# Altium schematic sheet Comm.SchDoc
size C; SheetNumber: 4; SheetTotal: 15
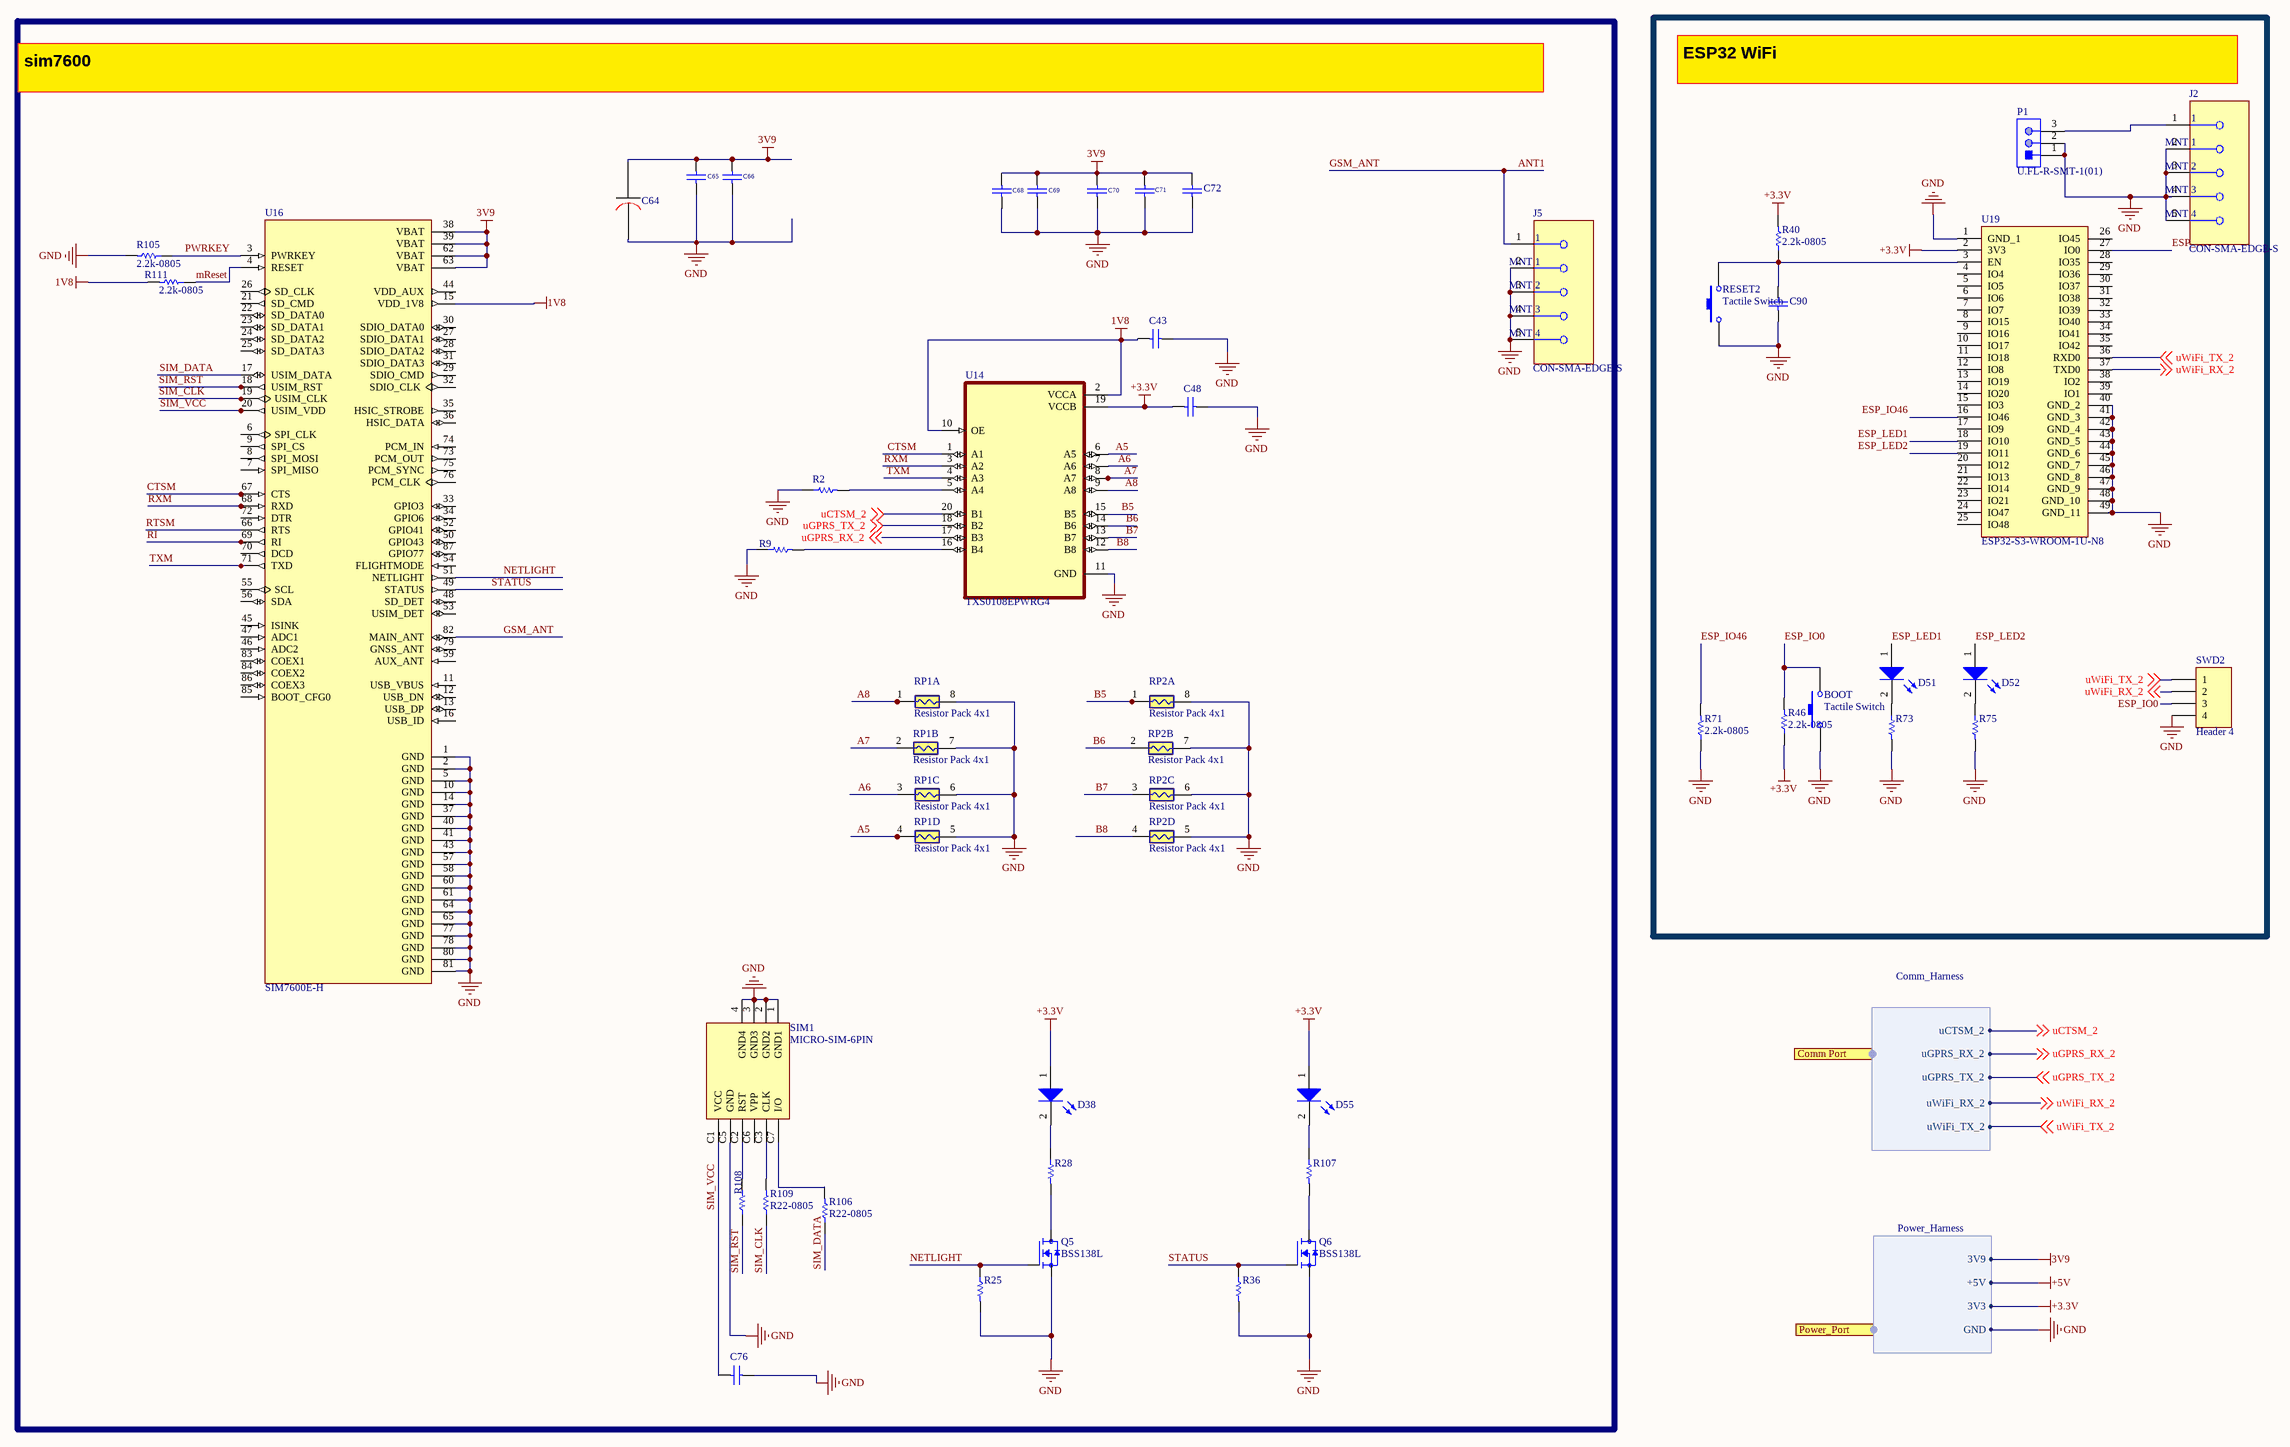
[diagram p0: Comm.SchDoc]

## Parts
BOOT  Tactile Switch  [CRF06031]
C43  Cap  [CRF06031]  (value not drawn)
C48  Cap  [CRF06031]  (value not drawn)
C64  470uF-10V  [CAPACITOR RADIAL SMT size F]  (value not drawn)
C65  (no value)  [CRF06031]
C66  (no value)  [CRF06031]
C68  (no value)  [CRF06031]
C69  (no value)  [CRF06031]
C70  (no value)  [CRF06031]
C71  (no value)  [CRF06031]
C72  (no value)  [CRF06031]
C76  (no value)  [CRF06031]
C90  (no value)  [CRF06031]
D38  LED_0805_green  [0805-LED]  (value not drawn)
D51  LED_0805_green  [0805-LED]  (value not drawn)
D52  LED_0805_green  [0805-LED]  (value not drawn)
D55  LED_0805_green  [0805-LED]  (value not drawn)
J2  CON-SMA-EDGE-S  [FP-CON-SMA-EDGE-S-MFG]
J5  CON-SMA-EDGE-S  [FP-CON-SMA-EDGE-S-MFG]
P1  U.FL-R-SMT-1(01)  [HRS-U.FL-R-SMT-3_V]
Q5  BSS138L  [BSS138L]
Q6  BSS138L  [BSS138L]
R2  (no value)  [CRF06031]
R9  (no value)  [CRF06031]
R25  (no value)  [crf06031]
R28  (no value)  [CRF06031]
R36  (no value)  [crf06031]
R40  2.2k-0805  [CRF06031]
R46  2.2k-0805  [CRF06031]
R71  2.2k-0805  [CRF06031]
R73  (no value)  [CRF06031]
R75  (no value)  [CRF06031]
R105  2.2k-0805  [CRF06031]
R106  R22-0805  [CRF06031]
R107  (no value)  [CRF06031]
R108  R22-0805  [CRF06031]  (value not drawn)
R109  R22-0805  [CRF06031]
R111  2.2k-0805  [CRF06031]
RESET2  Tactile Switch  [CRF06031]
RP1  Resistor Pack 4x1  [RP4x0603]  (parts A,B,C,D of 4)
RP2  Resistor Pack 4x1  [RP4x0603]  (parts A,B,C,D of 4)
SIM1  MICRO-SIM-6PIN  [MICRO-SIM-6PIN]
SWD2  Header 4  [HDR1X4]
U14  TXS0108EPWRG4  [SOP65P640X120-20N]
U16  SIM7600E-H  [IC_SIM7600E-H]
U19  ESP32-S3-WROOM-1U-N8  [ESP32S3WROOM1UN8]

## Ports
Comm Port (harness Comm_Harness), Power_Port (harness Power_Harness)

## Harnesses
Comm_Harness: uCTSM_2, uGPRS_RX_2, uGPRS_TX_2, uWiFi_TX_2, uWiFi_RX_2
Power_Harness: 3V9, +5V, 3V3, GND

## Nets
1V8: C43.1 R111.2 U14.2(VCCA) U14.10(OE) U16.15(VDD_1V8)
3V9: C64.1 C65.2 C66.2 C68.2 C69.2 C70.2 C71.2 C72.2 U16.38(VBAT) U16.39(VBAT) U16.62(VBAT) U16.63(VBAT) ; port Power_Port.3V9
+3.3V: C48.1 D38.1(A) D55.1(A) R40.2 R46.1 U14.19(VCCB) U19.2(3V3) ; port Power_Port.3V3
+5V: port Power_Port.+5V
GND: BOOT.1 C43.2 C48.2 C64.2 C65.1 C66.1 C68.1 C69.1 C70.1 C71.1 C72.1 C76.1 C90.1 J2.2(MNT_1) J2.3(MNT_2) J2.4(MNT_3) J2.5(MNT_4) J5.2(MNT_1) J5.3(MNT_2) J5.4(MNT_3) J5.5(MNT_4) P1.1 P1.2 Q5.S Q6.S R2.1 R9.1 R25.2 R36.2 R71.1 R73.2 R75.2 R105.2 RESET2.1 RP1.5 RP1.6 RP1.7 RP1.8 RP2.5 RP2.6 RP2.7 RP2.8 SIM1.1(GND1) SIM1.2(GND2) SIM1.3(GND3) SIM1.4(GND4) SIM1.C5(GND) SWD2.4 U14.11(GND) U16.1(GND) U16.2(GND) U16.5(GND) U16.10(GND) U16.14(GND) U16.37(GND) U16.40(GND) U16.41(GND) U16.43(GND) U16.57(GND) U16.58(GND) U16.60(GND) U16.61(GND) U16.64(GND) U16.65(GND) U16.77(GND) U16.78(GND) U16.80(GND) U16.81(GND) U19.1(GND_1) U19.40(GND_2) U19.41(GND_3) U19.42(GND_4) U19.43(GND_5) U19.44(GND_6) U19.45(GND_7) U19.46(GND_8) U19.47(GND_9) U19.48(GND_10) U19.49(GND_11) ; port Power_Port.GND
A5: RP1.4 U14.6(A5)
A6: RP1.3 U14.7(A6)
A7: RP1.2 U14.8(A7)
A8: RP1.1 U14.9(A8)
ANT1: J5.1 U16.82(MAIN_ANT)  [also labelled GSM_ANT]
B5: RP2.1 U14.15(B5)
B6: RP2.2 U14.14(B6)
B7: RP2.3 U14.13(B7)
B8: RP2.4 U14.12(B8)
CTSM: U14.1(A1) U16.67(CTS)
ESP_IO0: BOOT.2 R46.2 SWD2.3 U19.27(IO0)
ESP_IO46: R71.2 U19.16(IO46)
ESP_LED1: D51.1(A) U19.18(IO10)
ESP_LED2: D52.1(A) U19.19(IO11)
mReset: R111.1 U16.4(RESET)
NETLIGHT: Q5.G R25.1 U16.51(NETLIGHT)
PWRKEY: R105.1 U16.3(PWRKEY)
RI: U16.69(RI)
RTSM: U16.66(RTS)
RXM: U14.3(A2) U16.68(RXD)
SIM_CLK: R109.1 U16.19(USIM_CLK)
SIM_DATA: R106.1 U16.17(USIM_DATA)
SIM_RST: R108.1 U16.18(USIM_RST)
SIM_VCC: C76.2 SIM1.C1(VCC) U16.20(USIM_VDD)
STATUS: Q6.G R36.1 U16.49(STATUS)
TXM: U14.4(A3) U16.71(TXD)
uCTSM_2: U14.20(B1) ; off-sheet uCTSM_2, port Comm Port.uCTSM_2
uGPRS_RX_2: U14.17(B3) ; off-sheet uGPRS_RX_2, port Comm Port.uGPRS_RX_2
uGPRS_TX_2: U14.18(B2) ; off-sheet uGPRS_TX_2, port Comm Port.uGPRS_TX_2
uWiFi_RX_2: SWD2.2 U19.37(TXD0) ; off-sheet uWiFi_RX_2, port Comm Port.uWiFi_RX_2
uWiFi_TX_2: SWD2.1 U19.36(RXD0) ; off-sheet uWiFi_TX_2, port Comm Port.uWiFi_TX_2
NetC90_2: C90.2 R40.1 RESET2.2 U19.3(EN)
NetD38_2: D38.2(K) R28.1
NetD51_2: D51.2(K) R73.1
NetD52_2: D52.2(K) R75.1
NetD55_2: D55.2(K) R107.1
NetJ2_1: J2.1 P1.3
NetQ5_D: Q5.D R28.2
NetQ6_D: Q6.D R107.2
NetR2_2: R2.2 U14.5(A4)
NetR9_2: R9.2 U14.16(B4)
NetR106_2: R106.2 SIM1.C7(I/O)
NetR108_2: R108.2 SIM1.C2(RST)
NetR109_2: R109.2 SIM1.C3(CLK)

Not connected (* = marked no-connect by the designer): SIM1 C6(VPP); U16 6(SPI_CLK) 7(SPI_MISO) 8(SPI_MOSI) 9(SPI_CS) 11(USB_VBUS) 12(USB_DN) 13(USB_DP) 16(USB_ID) 21(SD_CMD) 22(SD_DATA0) 23(SD_DATA1) 24(SD_DATA2) 25(SD_DATA3) 26(SD_CLK) 27(SDIO_DATA1) 28(SDIO_DATA2) 29(SDIO_CMD) 30(SDIO_DATA0) 31(SDIO_DATA3) 32(SDIO_CLK) 33(GPIO3) 34(GPIO6) 35(HSIC_STROBE) 36(HSIC_DATA) 44(VDD_AUX) 45(ISINK) 46(ADC2) 47(ADC1) 48(SD_DET) 50(GPIO43) 52(GPIO41) 53(USIM_DET) 54(FLIGHTMODE) 55(SCL) 56(SDA) 59(AUX_ANT) 70(DCD) 72(DTR) 73(PCM_OUT) 74(PCM_IN) 75(PCM_SYNC) 76(PCM_CLK) 79(GNSS_ANT) 83(COEX1) 84(COEX2) 85(BOOT_CFG0) 86(COEX3) 87(GPIO77); U19 4(IO4) 5(IO5) 6(IO6) 7(IO7) 8(IO15) 9(IO16) 10(IO17) 11(IO18) 12(IO8) 13(IO19) 14(IO20) 15(IO3) 17(IO9) 20(IO12) 21(IO13) 22(IO14) 23(IO21) 24(IO47) 25(IO48) 26(IO45) 28(IO35) 29(IO36) 30(IO37) 31(IO38) 32(IO39) 33(IO40) 34(IO41) 35(IO42) 38(IO2) 39(IO1)

## Notes on the sheet
- sim7600
- ESP32 WiFi

## Library data of the parts
BOOT RESET2 = Switch PB: Manufacturer_P/N: 430152043836; ClassName: WiFi-ESP32; Digi-Key_Part_Number: 732-6992-2-ND; JLC P/N: C6687535
C43 C48 C65 C66 C68-C72 C76 = Cap: Capacitor; Manufacturer_P/N: GCM21BR72A104KA37L; Digi-Key_Part_Number: 490-4789-1-ND; ClassName: Sim7600; JLC P/N: C85866
C64 = CAP_E_SMD: SMD_Electrolyt; Manufacturer_P/N: EEE-HC1H101P; Digi-Key_Part_Number: P19732TR-ND; ClassName: Sim7600; JLC P/N: C336718
C90 = Cap: Capacitor; Manufacturer_P/N: GRM21BC72A105KE01L; ClassName: WiFi-ESP32; Digi-Key_Part_Number: 490-14464-2-ND; JLC P/N: C385039
D38 D51 D52 D55 = LED_0805: Manufacturer_P/N: NCD0805R1; JLC P/N: C84256
  D38 D55: ClassName: Sim7600
  D51 D52: ClassName: WiFi-ESP32
J2 J5 = CMP-204357-000001-1: CONN SMA JACK STR EDGE MNT; Octopart: https://octopart.com/con-sma-edge-s-rf+solutions-70967450; Manufacturer Part Number: CON-SMA-EDGE-S; Digikey Description: CONN SMA JACK STR EDGE MNT; Digi-Key_Part_Number: CON-SMA-EDGE-S-ND; Manufacturer_P/N: CON-SMA-EDGE-S; JLC P/N: C5356059
P1 = CMP-2000-05153-1: Ultra Small Coaxial Connector, 6 GHz, -40 to 90 degC, 3-Pin SMD, RoHS, Bulk; Minimum Quantity: UltraMiniatureCoaxial; Manufacturer URL: https://www.hirose.com; Quantity Available: Bulk; Digi-Key_Part_Number: 26-U.FL-R-SMT-1(01)-ND; Manufacturer_P/N: U.FL-R-SMT-1(01); JLC P/N: C598199
Q5 Q6 = BSS138L: smd; MF: ON Semiconductor; MP: BSS138L; Digi-Key_Part_Number: BSS138LTR-ND; ClassName: Sim7600; Manufacturer_P/N: BSS138L; JLC P/N: C890265
R2 R9 = ERQF06: smd; Manufacturer_P/N: RC0805FR-0747KL; Digi-Key_Part_Number: 311-47.0KCRTR-ND; ClassName: Sim7600; JLC P/N: C126351
R25 R28 R36 R73 R75 R107 = ERQF06: smd; Manufacturer_P/N: RC0805FR-074K7L; Digi-Key_Part_Number: 311-4.70KCRTR-ND; JLC P/N: C60816
  R25 R28 R36 R107: ClassName: Sim7600
  R73 R75: ClassName: WiFi-ESP32
R40 R46 R71 R105 R111 = Res1: Resistor; Manufacturer_P/N: RC0805FR-072K2L; Digi-Key_Part_Number: 311-2.20KCRTR-ND; JLC P/N: C114561
  R40 R46 R71: ClassName: WiFi-ESP32
  R105 R111: ClassName: Sim7600
R106 R108 R109 = Res1: Resistor; Manufacturer_P/N: RC0805FR-0722RL; Digi-Key_Part_Number: 311-22.0CRTR-ND; ClassName: Sim7600; JLC P/N: C107702
RP1 RP2 = Resistor Pack 4*1: Manufacturer_P/N: YC164-JR-0710KL; Digi-Key_Part_Number: YC164J-10KTR-ND; ClassName: Sim7600; JLC P/N: C107374
SIM1 = MICRO-SIM-6PIN: Manufacturer_P/N: MSIM-2-A; Digi-Key_Part_Number: 2223-MSIM-2-ATR-ND; ClassName: Sim7600; JLC P/N: C37170261
SWD2 = Header 4: Header, 4-Pin; ClassName: WiFi-ESP32
U14 = TXS0108EPWRG4: 8-bit bidirectional voltage-level shifter for open-drain and push-pull application 20-TSSOP -40 to 85; MF: Texas Instruments; MP: TXS0108EPWRG4; Purchase-URL: https://pricing.snapeda.com/search/part/TXS0108EPWRG4/?ref=eda; Digi-Key_Part_Number: 296-23011-2-ND; Supplier 1: Mouser; Supplier Part Number 1: 595-TXS0108EPWRG4; ClassName: Sim7600_LevelShifter; Manufacturer_P/N: TXS0108EPWR; JLC P/N: C17206
U16 = SIM7600E-H: Multi-Band LTE-TDD/LTE-FDD/HSPA+ and GSM/GPRS/EDGE module; MP: SIM7600E-H; Digi-Key_Part_Number: 3781-SIM7600E-H-ND; Supplier 1: Digikey; Supplier Part Number 1: 3781-SIM7600E-H-ND; ClassName: Sim7600; Manufacturer_P/N: SIM7600E-H; JLC P/N: C5338795
U19 = ESP32-S3-WROOM-1U-N8: Integrated Circuit; Manufacturer_Name: Espressif Systems; Manufacturer_Part_Number: ESP32-S3-WROOM-1U-N8; Mouser Part Number: 356-ESP32S3WROOM1UN8; Digi-Key_Part_Number: 1965-ESP32-S3-WROOM-1U-N8TR-ND; ClassName: WiFi-ESP32; Manufacturer_P/N: ESP32-S3-WROOM-1U-N8; JLC P/N: C2980297